# Altium schematic sheet mic.SchDoc
size A
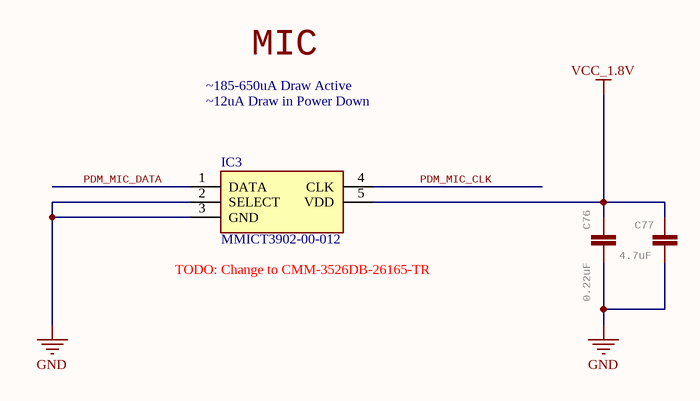
[diagram p0: mic.SchDoc]

## Parts
C76  0.22uF  [C0201]
C77  4.7uF  [0402-CAP]
IC3  MMICT3902-00-012  [MMICT390200012]

## Nets
GND: C76.2 C77.1 IC3.2(SELECT) IC3.3(GND)
VCC_1.8V: C76.1 C77.2 IC3.5(VDD)
PDM_MIC_CLK: IC3.4(CLK)
PDM_MIC_DATA: IC3.1(DATA)

## Notes on the sheet
- ~12uA Draw in Power Down
- ~185-650uA Draw Active
- MIC
- (near IC3) TODO: Change to CMM-3526DB-26165-TR

## Library data of the parts
C76 = C-EUC0201: CAPACITOR, European symbol; MPN: GRM033R60J224ME15D; GateName_1: G$1; SymbolName_1: C-EU; POPULARITY: 0; DeviceName: C0201; LibraryName: rcl; DeviceSetName: C-EU; SPICEPREFIX: C; Part Number: GRM033R60J224ME15D
C77 = CAP0402-CAP: CapacitorStandard 0603 ceramic capacitor, and 0.1" leaded capacitor.; MPN: JMK105BBJ475MV-F; GateName_1: G$1; SymbolName_1: CAP; DeviceName: 0402-CAP; LibraryName: sfe; DeviceSetName: CAP; Part Number: JMK105BBJ475MV-F
IC3 = MMICT3902-00-012: Integrated Circuit; Manufacturer_Name: TDK; Datasheet Link: http://invensense.tdk.com/wp-content/uploads/2020/05/DS-000357-T3902-v1.0.pdf; Height: 1.13mm; Manufacturer_Part_Number: MMICT3902-00-012; Mouser Part Number: 410-MMICT3902-00-012; Mouser Price/Stock: https://www.mouser.co.uk/ProductDetail/TDK-InvenSense/MMICT3902-00-012?qs=yqaQSyyJnNi1lpqXyrpxOA%3D%3D; Arrow Part Number: MMICT3902-00-012; Arrow Price/Stock: https://www.arrow.com/en/products/mmict3902-00-012/invensense?region=nac; Part Number: MMICT3902-00-012; MPN: MMICT3902-00-012